# Altium schematic sheet Power_5v_3v3.SchDoc
size C
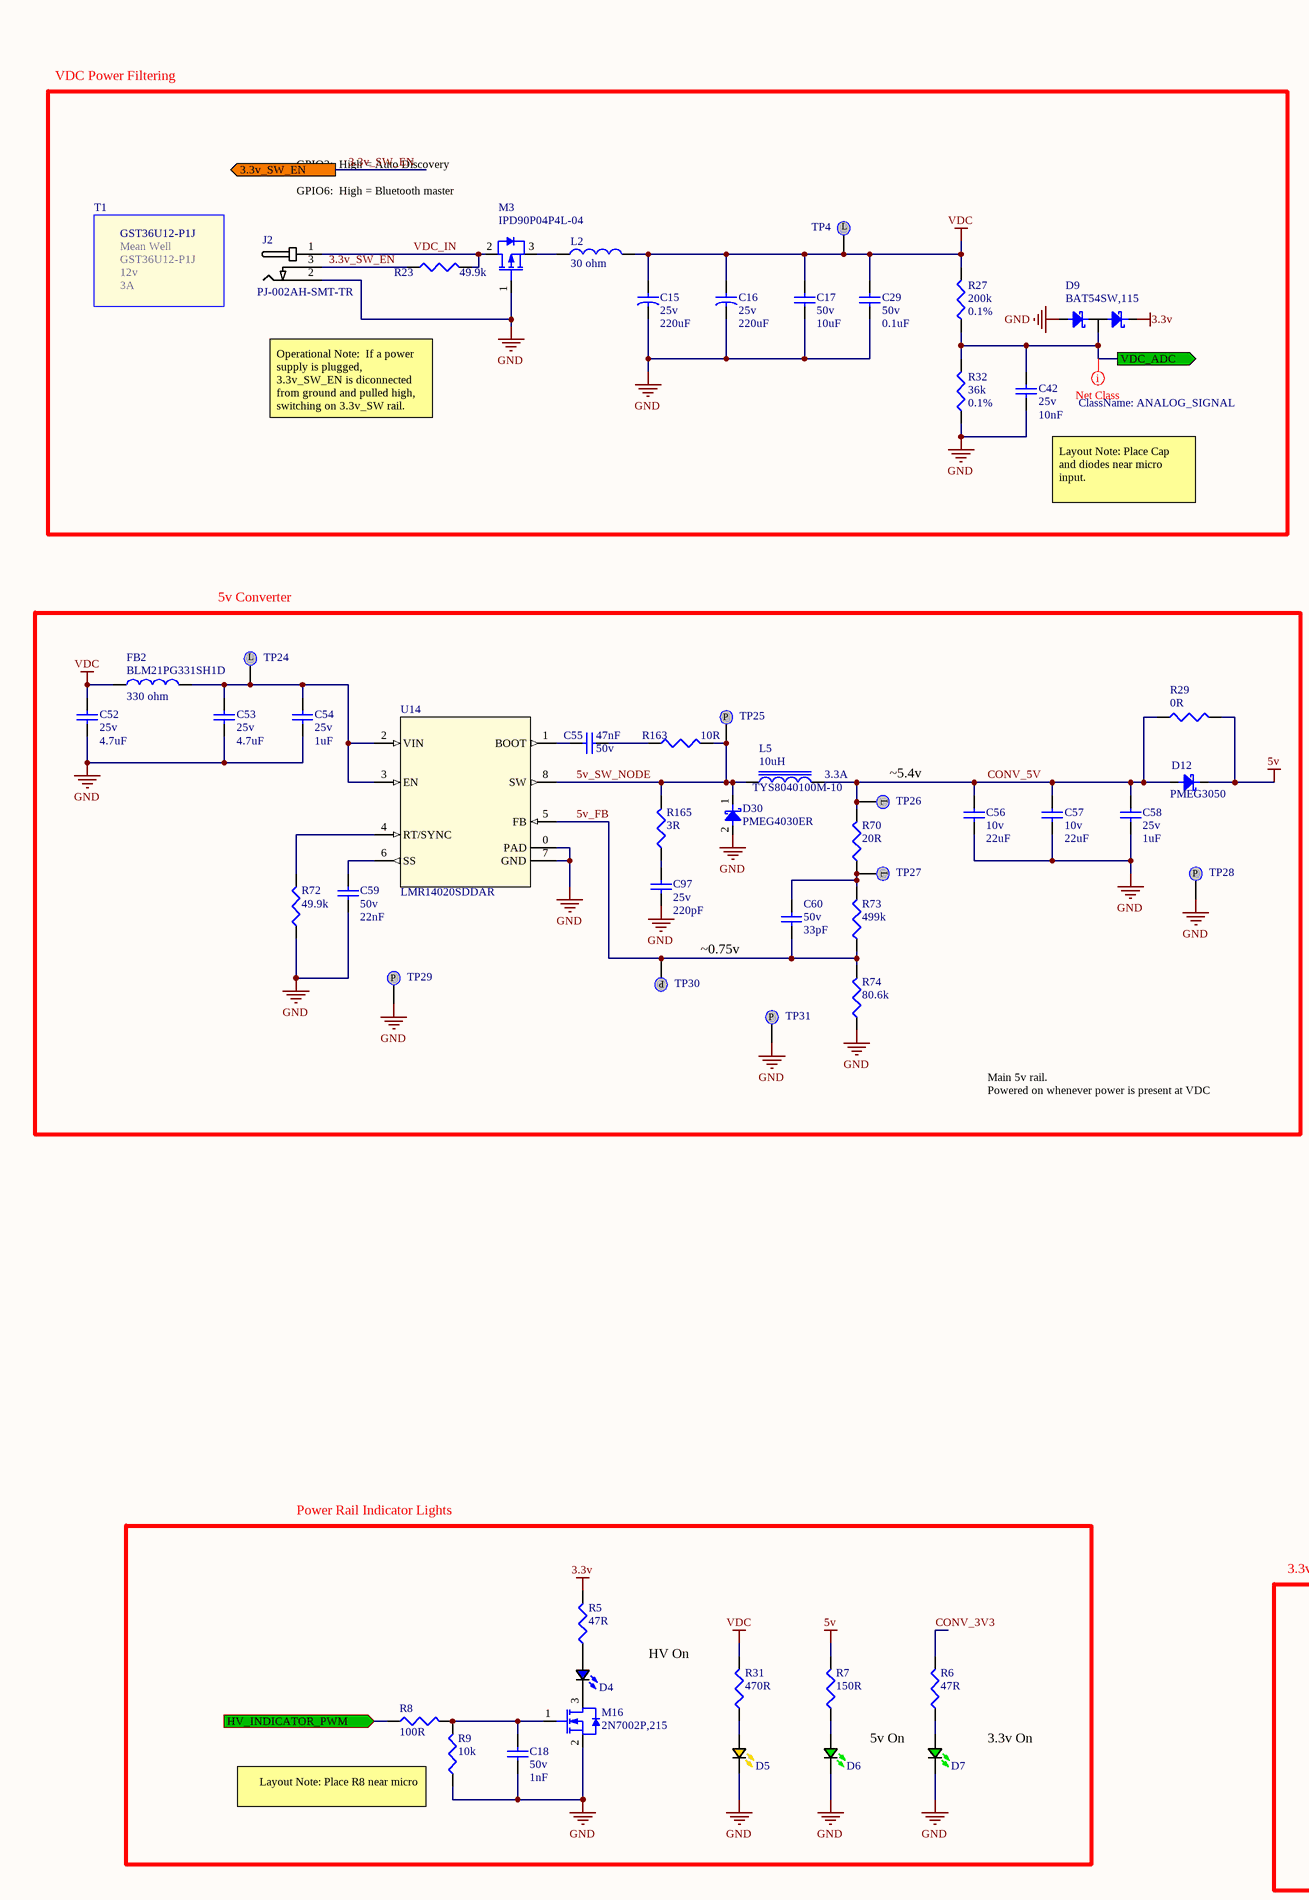
[diagram p0: Power_5v_3v3.SchDoc, left]
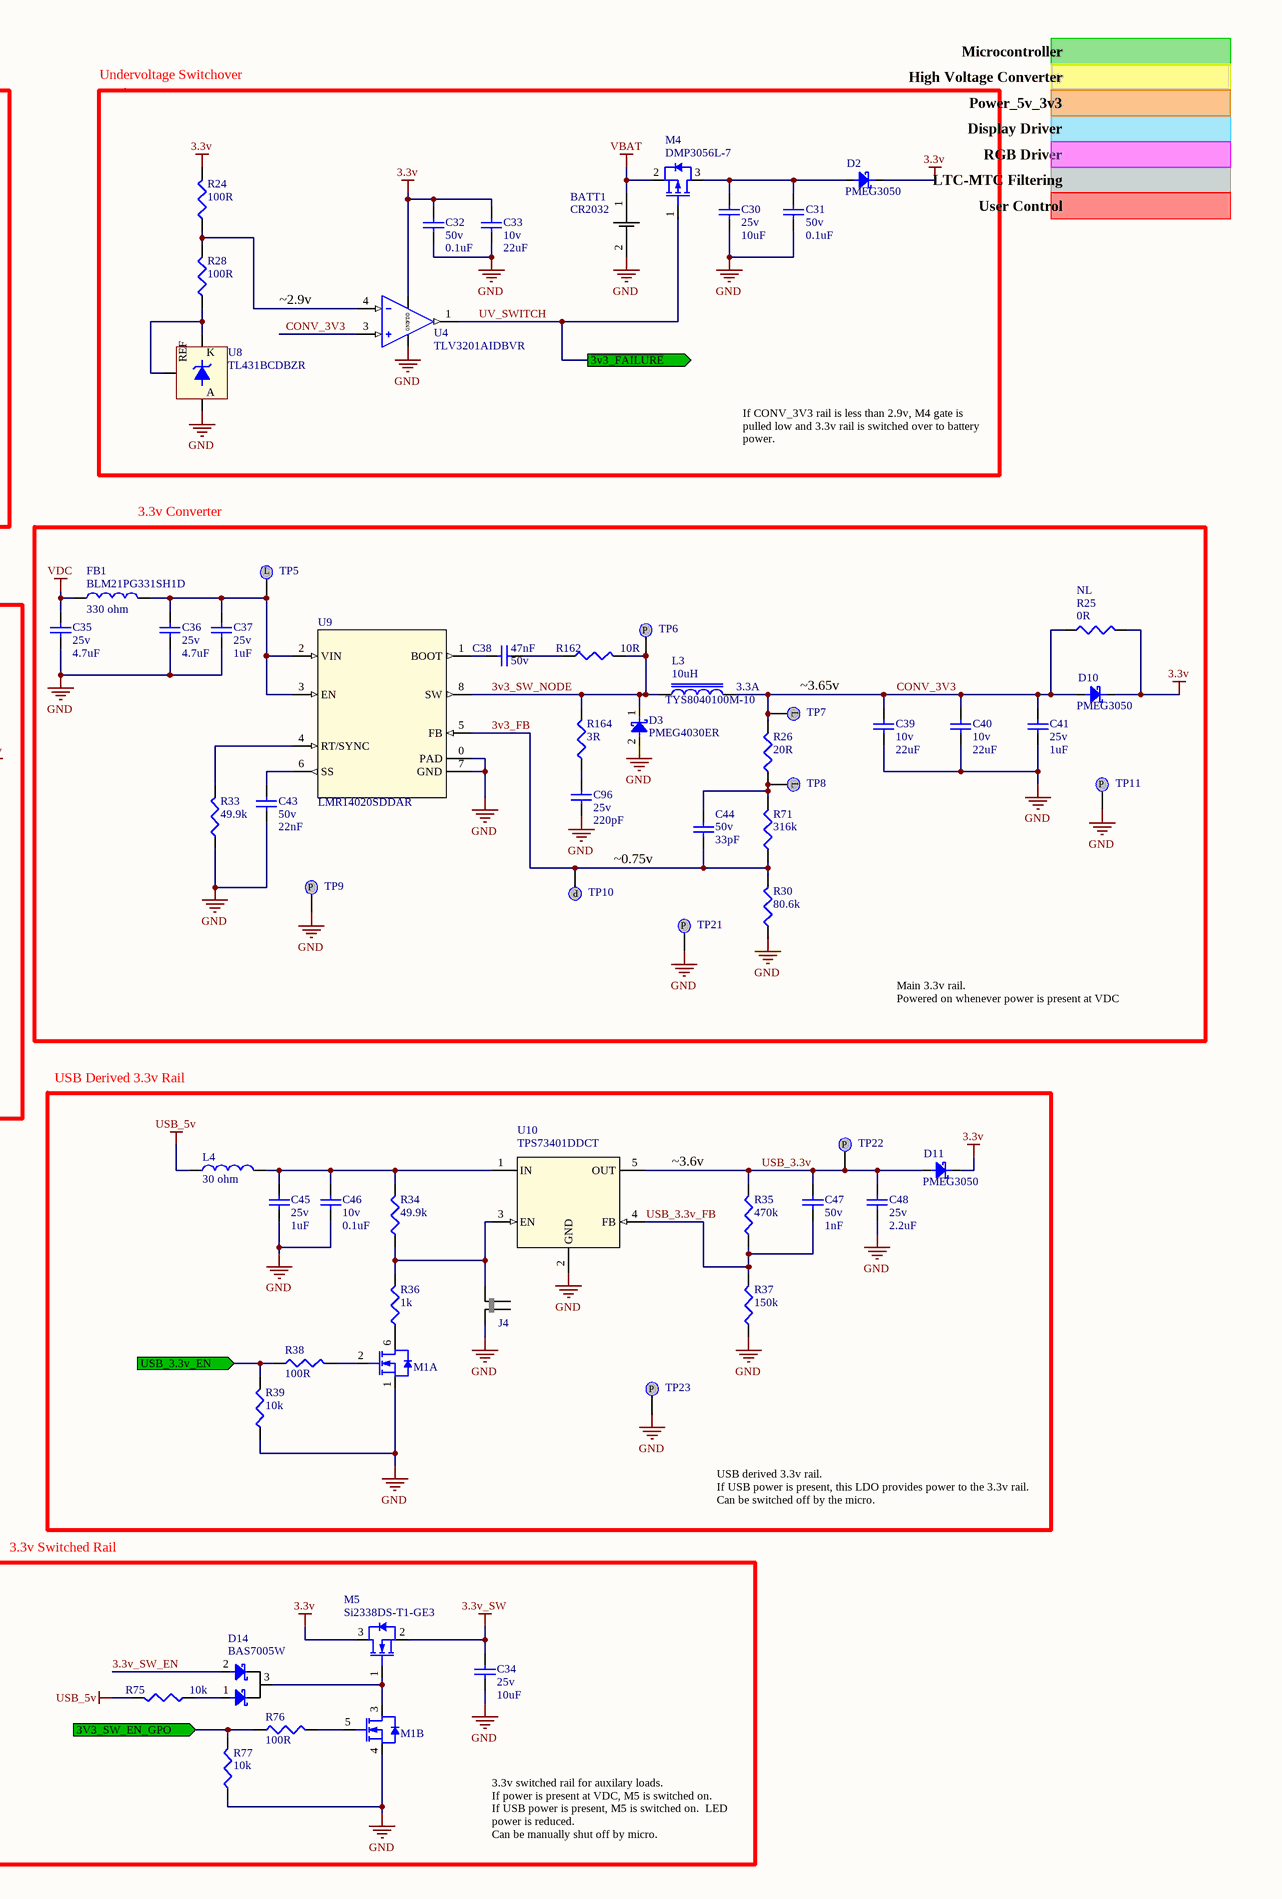
[diagram p1: Power_5v_3v3.SchDoc, right]

## Parts
BATT1  CR2032  [2032 Holder]
C15  Voltage: 25v  [SMD ELEC CAP (D=6.3, L=7.7, H=8)]  (hidden comment: 220uF)
C16  Voltage: 25v  [SMD ELEC CAP (D=6.3, L=7.7, H=8)]  (hidden comment: 220uF)
C17  Voltage: 50v  [CAP1206R]  (hidden comment: 10uF)
C18  Voltage: 50v  [CAP0402R]  (hidden comment: 1nF)
C29  Voltage: 50v  [CAP0603R]  (hidden comment: 0.1uF)
C30  Voltage: 25v  [CAP1206R]  (hidden comment: 10uF)
C31  Voltage: 50v  [CAP0603R]  (hidden comment: 0.1uF)
C32  Voltage: 50v  [CAP0603R]  (hidden comment: 0.1uF)
C33  Voltage: 10v  [CAP1210R]  (hidden comment: 22uF)
C34  Voltage: 25v  [CAP1206R]  (hidden comment: 10uF)
C35  Voltage: 25v  [CAP1206R]  (hidden comment: 4.7uF)
C36  Voltage: 25v  [CAP1206R]  (hidden comment: 4.7uF)
C37  Voltage: 25v  [CAP0805R]  (hidden comment: 1uF)
C38  Voltage: 50v  [CAP0603R]  (hidden comment: 47nF)
C39  Voltage: 10v  [CAP1210R]  (hidden comment: 22uF)
C40  Voltage: 10v  [CAP1210R]  (hidden comment: 22uF)
C41  Voltage: 25v  [CAP0805R]  (hidden comment: 1uF)
C42  Voltage: 25v  [CAP0402R]  (hidden comment: 10nF)
C43  Voltage: 50v  [CAP0603R]  (hidden comment: 22nF)
C44  Voltage: 50v  [CAP0402R]  (hidden comment: 33pF)
C45  Voltage: 25v  [CAP0805R]  (hidden comment: 1uF)
C46  Voltage: 10v  [CAP0402R]  (hidden comment: 0.1uF)
C47  Voltage: 50v  [CAP0402R]  (hidden comment: 1nF)
C48  Voltage: 25v  [CAP1206R]  (hidden comment: 2.2uF)
C52  Voltage: 25v  [CAP1206R]  (hidden comment: 4.7uF)
C53  Voltage: 25v  [CAP1206R]  (hidden comment: 4.7uF)
C54  Voltage: 25v  [CAP0805R]  (hidden comment: 1uF)
C55  Voltage: 50v  [CAP0603R]  (hidden comment: 47nF)
C56  Voltage: 10v  [CAP1210R]  (hidden comment: 22uF)
C57  Voltage: 10v  [CAP1210R]  (hidden comment: 22uF)
C58  Voltage: 25v  [CAP0805R]  (hidden comment: 1uF)
C59  Voltage: 50v  [CAP0603R]  (hidden comment: 22nF)
C60  Voltage: 50v  [CAP0402R]  (hidden comment: 33pF)
C96  Voltage: 25v  [CAP0402R]  (hidden comment: 220pF)
C97  Voltage: 25v  [CAP0402R]  (hidden comment: 220pF)
D2  PMEG3050  [SOD128]
D3  PMEG4030ER  [SOD-123]
D4  LTST-C193TBKT-5A  [LED Blue 0603]  (value not drawn)
D5  LTST-C190AKT  [LED Amber 0603]  (value not drawn)
D6  LTST-S270KGKT  [LED Green 0603]  (value not drawn)
D7  LTST-S270KGKT  [LED Green 0603]  (value not drawn)
D9  BAT54SW,115  [SOT-323]
D10  PMEG3050  [SOD128]
D11  PMEG3050  [SOD128]
D12  PMEG3050  [SOD128]
D14  BAS7005W  [SOT-323]
D30  PMEG4030ER  [SOD-123]
FB1  BLM21PG331SH1D  IMPEDANCE: 330 ohm  [RES0805R]
FB2  BLM21PG331SH1D  IMPEDANCE: 330 ohm  [RES0805R]
J2  PJ-002AH-SMT-TR  [PJ-002AH-SMT-TR]
J4  None  [Jumper_2.54mm_2x1]  (value not drawn)
L2  30 ohm  [RES0805R]
L3  10uH  CURRENT: 3.3A  [TYS8040100M-10]
L4  30 ohm  [RES0805R]
L5  10uH  CURRENT: 3.3A  [TYS8040100M-10]
M1  NX3020NAKV,115  [SOT666-6N]  (value not drawn)  (parts A,B of 2)
M3  IPD90P04P4L-04  [DPAK2]
M4  DMP3056L-7  [SOT23-3M]
M5  Si2338DS-T1-GE3  [SOT23-3M]
M16  2N7002P,215  [SOT23-3M]
R5  47R  [RES0603R]
R6  47R  [RES0603R]
R7  150R  [RES0603R]
R8  100R  [RES0402R]
R9  10k  [RES0402R]
R23  49.9k  [RES0402R]
R24  100R  [RES0402R]
R25  Load: NL  [RES1206R]  (hidden comment: 0R)
R26  20R  [RES0402R]
R27  Tolerance: 0.1%  [RES0402R]  (hidden comment: 200k)
R28  100R  [RES0402R]
R29  0R  [RES1206R]
R30  80.6k  [RES0402R]
R31  470R  [RES0603R]
R32  Tolerance: 0.1%  [RES0402R]  (hidden comment: 36k)
R33  49.9k  [RES0402R]
R34  49.9k  [RES0402R]
R35  470k  [RES0402R]
R36  1k  [RES0402R]
R37  150k  [RES0402R]
R38  100R  [RES0402R]
R39  10k  [RES0402R]
R70  20R  [RES0402R]
R71  316k  [RES0402R]
R72  49.9k  [RES0402R]
R73  499k  [RES0402R]
R74  80.6k  [RES0402R]
R75  10k  [RES0402R]
R76  100R  [RES0402R]
R77  10k  [RES0402R]
R162  10R  [RES0402R]
R163  10R  [RES0402R]
R164  3R  [RES0603R]
R165  3R  [RES0603R]
T1  GST36U12-P1J  MFG: Mean Well  VOUT: 12v  CURRENT: 3A  (mechanical)
TP4  5001  [5001 Testpoint]  (value not drawn)
TP5  5001  [5001 Testpoint]  (value not drawn)
TP6  NONE  [TESTPOINT - 1.5mm Round Pad]  (value not drawn)
TP7  5001  [5001 Testpoint]  (value not drawn)
TP8  5001  [5001 Testpoint]  (value not drawn)
TP9  NONE  [TESTPOINT - 1.5mm Round Pad]  (value not drawn)
TP10  NONE  [TESTPOINT - 1.5mm Round Pad]  (value not drawn)
TP11  NONE  [TESTPOINT - 1.5mm Round Pad]  (value not drawn)
TP21  NONE  [TESTPOINT - 1.5mm Round Pad]  (value not drawn)
TP22  NONE  [TESTPOINT - 1.5mm Round Pad]  (value not drawn)
TP23  NONE  [TESTPOINT - 1.5mm Round Pad]  (value not drawn)
TP24  5001  [5001 Testpoint]  (value not drawn)
TP25  NONE  [TESTPOINT - 1.5mm Round Pad]  (value not drawn)
TP26  5001  [5001 Testpoint]  (value not drawn)
TP27  5001  [5001 Testpoint]  (value not drawn)
TP28  NONE  [TESTPOINT - 1.5mm Round Pad]  (value not drawn)
TP29  NONE  [TESTPOINT - 1.5mm Round Pad]  (value not drawn)
TP30  NONE  [TESTPOINT - 1.5mm Round Pad]  (value not drawn)
TP31  NONE  [TESTPOINT - 1.5mm Round Pad]  (value not drawn)
U4  TLV3201AIDBVR  [SOT23-5]
U8  TL431BCDBZR  [SOT23-3M]
U9  LMR14020SDDAR  [HSOIC-8]
U10  TPS73401DDCT  [SOT23-5]
U14  LMR14020SDDAR  [HSOIC-8]

## Blocks framed on the sheet
VDC Power Filtering: C15-C17 C29 C42 D9 J2 L2 M3 R23 R27 R32 T1 TP4
3.3v Switched Rail: C34 D14 M1 M5 R75-R77

## Ports
3.3v_SW_EN (out), 3V3_SW_EN_GPO (in), HV_INDICATOR_PWM (in), USB_3.3v_EN (in), VDC_ADC (out), ~{3v3_FAILURE} (out)

## Nets
3.3v: C32.1 C33.1 D2.1(K) D9.2(A) D10.1(K) D11.1(K) M5.3(DRAIN) R5.2 R24.2 R25.2 U4.5(VDD)
3.3v_SW: C34.1 M5.2(SOURCE)
5v: D12.1(K) R7.2 R29.2
GND: BATT1.2 C15.1 C16.1 C17.2 C18.2 C29.2 C30.2 C31.2 C32.2 C33.2 C34.2 C35.2 C36.2 C37.2 C39.2 C40.2 C41.2 C42.2 C43.2 C45.2 C46.2 C48.2 C52.2 C53.2 C54.2 C56.2 C57.2 C58.2 C59.2 C96.2 C97.2 D3.2(A) D5.1(K) D6.1(K) D7.1(K) D9.1(A) D30.2(A) J2.2(RING) J4.1 M1.1(S1) M1.4(S2) M3.1(GATE) M16.2(SOURCE) R9.1 R30.1 R32.1 R33.1 R37.1 R39.1 R72.1 R74.1 R77.1 TP9.1 TP11.1 TP21.1 TP23.1 TP28.1 TP29.1 TP31.1 U4.2(GND) U8.3(A) U9.0(PAD) U9.7(GND) U10.2(GND) U14.0(PAD) U14.7(GND)
USB_5v: L4.1 R75.2
VBAT: BATT1.1 M4.2(DRAIN)
VDC: C15.2 C16.2 C17.1 C29.1 C35.1 C52.1 FB1.1 FB2.1 L2.2 R27.2 R31.2 TP4.1
3.3v_SW_EN: D14.2(A2) J2.3(SWITCH) R23.1 ; port 3.3v_SW_EN
3v3_FB: C44.2 R30.2 R71.1 TP10.1 U9.5(FB)
3V3_SW_EN_GPO: R76.1 R77.2 ; port 3V3_SW_EN_GPO
3v3_SW_NODE: D3.1(K) L3.1 R162.2 R164.2 TP6.1 U9.8(SW)
5v_FB: C60.2 R73.1 R74.2 TP30.1 U14.5(FB)
5v_SW_NODE: D30.1(K) L5.1 R163.2 R165.2 TP25.1 U14.8(SW)
CONV_3V3: C39.1 C40.1 C41.1 D10.2(A) L3.2 R6.2 R25.1 R26.2 TP7.1 U4.3(+)
CONV_5V: C56.1 C57.1 C58.1 D12.2(A) L5.2 R29.1 R70.2 TP26.1
HV_INDICATOR_PWM: R8.1 ; port HV_INDICATOR_PWM
USB_3.3v: C47.1 C48.1 D11.2(A) R35.2 TP22.1 U10.5(OUT)
USB_3.3v_EN: R38.1 R39.2 ; port USB_3.3v_EN
USB_3.3v_FB: C47.2 R35.1 R37.2 U10.4(FB)
UV_SWITCH: M4.1(GATE) U4.1(OUT) ; port ~{3v3_FAILURE}
VDC_ADC: C42.1 D9.3(AK) R27.1 R32.2 ; port VDC_ADC
VDC_IN: J2.1(PIN) M3.2(DRAIN) R23.2
NetC18_1: C18.1 M16.1(GATE) R8.2 R9.2
NetC30_1: C30.1 C31.1 D2.2(A) M4.3(SOURCE)
NetC36_1: C36.1 C37.1 FB1.2 TP5.1 U9.2(VIN) U9.3(EN)
NetC38_1: C38.1 U9.1(BOOT)
NetC38_2: C38.2 R162.1
NetC43_1: C43.1 U9.6(SS)
NetC44_1: C44.1 R26.1 R71.2 TP8.1
NetC45_1: C45.1 C46.1 L4.2 R34.2 U10.1(IN)
NetC53_1: C53.1 C54.1 FB2.2 TP24.1 U14.2(VIN) U14.3(EN)
NetC55_1: C55.1 U14.1(BOOT)
NetC55_2: C55.2 R163.1
NetC59_1: C59.1 U14.6(SS)
NetC60_1: C60.1 R70.1 R73.2 TP27.1
NetC96_1: C96.1 R164.1
NetC97_1: C97.1 R165.1
NetD4_1: D4.1(K) M16.3(DRAIN)
NetD4_2: D4.2(A) R5.1
NetD5_2: D5.2(A) R31.1
NetD6_2: D6.2(A) R7.1
NetD7_2: D7.2(A) R6.1
NetD14_1: D14.1(A1) R75.1
NetD14_3: D14.3(C) M1.3(D2) M5.1(GATE)
NetJ4_2: J4.2 R34.1 R36.2 U10.3(EN)
NetL2_1: L2.1 M3.3(SOURCE)
NetM1_2: M1.2(G1) R38.2
NetM1_5: M1.5(G2) R76.2
NetM1_6: M1.6(D1) R36.1
NetR24_1: R24.1 R28.2 U4.4(-)
NetR28_1: R28.1 U8.1(K) U8.2(REF)
NetR33_2: R33.2 U9.4(RT/SYNC)
NetR72_2: R72.2 U14.4(RT/SYNC)

## Layout directives
net class ANALOG_SIGNAL: VDC_ADC

## Notes on the sheet
- Microcontroller
- High Voltage Converter
- Undervoltage Switchover
- Display Driver
- Power_5v_3v3
- RGB Driver
- LTC-MTC Filtering
- User Control
- ~2.9v
- Operational Note:  If a power supply is plugged, 3.3v_SW_EN is diconnected from ground and pulled high, switching on 3.3v_SW rail.
- If CONV_3V3 rail is less than 2.9v, M4 gate is pulled low and 3.3v rail is switched over to battery power.
- (near C42) Layout Note: Place Cap and diodes near micro input.
- 3.3v Converter
- 5v Converter
- (near TP7) ~3.65v
- (near TP26) ~5.4v
- ~0.75v
- Main 3.3v rail.
  Powered on whenever power is present at VDC
- Main 5v rail.
  Powered on whenever power is present at VDC
- USB Derived 3.3v Rail
- ~3.6v
- Power Rail Indicator Lights
- USB derived 3.3v rail.
  If USB power is present, this LDO provides power to the 3.3v rail.
  Can be switched off by the micro.
- HV On
- (near D6) 5v On
- (near D7) 3.3v On
- (near R9) Layout Note: Place R8 near micro
- 3.3v switched rail for auxilary loads.
  If power is present at VDC, M5 is switched on.
  If USB power is present, M5 is switched on.  LED power is reduced.
  Can be manually shut off by micro.
- (in symbol GST36U12-P1J) GPIO3:  High = Auto Discovery / GPIO6:  High = Bluetooth master / GPIO7:  Low = 115200bps, High = 9600bps /
- (in symbol Testpoint 1.5mm Pad) P
- (in symbol Testpoint Loop) L

## Library data of the parts
BATT1 = 2032 Coin Cell Holder: SMD Coin Cell Holder for CR2032; MFG_PN: SMTU2032-LF.TR; MFG: RENATA; CELL_TYPE: CR2032
C15 C16 = 220uF / 25v: Tolerance: 20%; MFG_PN: EEE-FTE221XAP; MFG: PANASONIC; ESR: 160mohm; LOAD: NL; Value: 220uF
C17 = 10uF 50v (1206): Tolerance: 10%; MFG_PN: C3216X5R1H106K160AB; MFG: TDK; LOAD: NL; Value: 10uF
C18 C47 = 1nF 50v (0402): Tolerance: 10%; MFG_PN: VJ0402Y102KXAAC; MFG: Vishay; LOAD: NL; Value: 1nF
C29 C31 C32 = 0.1uF 50v (0603): MFG_PN: VJ0603V104ZXAPW1BC; MFG: Vishay; LOAD: NL; Value: 0.1uF
C30 C34 = 10uF 25v (1206): Tolerance: 10%; MFG_PN: GRJ31CR71E106KE11L; MFG: MURATA; LOAD: NL; Value: 10uF
C33 C39 C40 C56 C57 = 22uF 10v (1210): Tolerance: 10%; MFG_PN: GCM32ER71A226ME12L; MFG: MURATA; LOAD: NL; Value: 22uF
C35 C36 C52 C53 = 4.7uF 25v (1206): Tolerance: 10%; MFG_PN: GCM31CR71E475KA55L; MFG: Murata; LOAD: NL; Value: 4.7uF
C37 C41 C45 C54 C58 = 1uF 25v (0805): MFG_PN: VJ0805V105ZXXTW1BC; MFG: Vishay; LOAD: NL; Value: 1uF
C38 C55 = 47nF 50v (0603): Tolerance: 10%; MFG_PN: VJ0603Y473KXACW1BC; MFG: VISHAY; Value: 47nF
C42 = 10nF 25v (0402): Tolerance: 5%; MFG_PN: VJ0402Y103JXXAC; MFG: Vishay; LOAD: NL; Value: 10nF
C43 C59 = 22nF 50v (0603): Tolerance: 5%; MFG1_PN: VJ0603Y223KXACW1BC; MFG1: Vishay; Value: 22nF
C44 C60 = 33pF 50v (0402): Tolerance: 5%; MFG_PN: VJ0402A330JXACW1BC; MFG: Vishay; LOAD: NL; Value: 33pF
C46 = 0.1uF 10v (0402): Tolerance: 20%; MFG_PN: VJ0402G104MXQCW1BC; MFG: Vishay; LOAD: NL; Value: 0.1uF
C48 = 2.2uF 25v (1206): MFG1_PN: VJ1206V225ZXXRW1BC; MFG1: Vishay; Value: 2.2uF
C96 C97 = 220pF 25v (0402): Tolerance: 5%; MFG_PN: GRM1555C1E221JA01D; MFG: Murata; LOAD: NL; Value: 220pF
D2 D10-D12 = PMEG3050EP: MFG: NXP; CURRENT: 5A; VF: 0.35v; MFG_PN: PMEG3050EP,115
D3 D30 = PMEG4030ER: MFG: NXP; CURRENT: 3A; VF: 0.54v; MFG_PN: PMEG4030ER,115
D4 = LED Blue 0603: MFG: Lite On; VFORWARD: 2.8v; CURRENT: 20mA; COLOR: Blue; MFG_PN: LTST-C193TBKT-5A
D5 = LED Amber 0603: MFG: Lite On; VFORWARD: 2.1v; CURRENT: 20mA; COLOR: Amber; MFG_PN: LTST-C190AKT
D6 D7 = LED Green 0603: MFG: Lite On; VFORWARD: 2v; CURRENT: 20mA; COLOR: Green; MFG_PN: LTST-S270KGKT
D9 = BAT54S: Series connected dual Schottky diode; MFG: NXP; CONFIG: SERIES DUAL; REV_VOLTAGE: 30v; MFG_PN: BAT54SW,115
D14 = BAS7005WH6327XTSA1: Schottky, Dual, Common Cathode; MFG: Vishay; Value: *; CONFIGURATION: COMMON CATHODE; MFG_PN: BAS7005WH6327XTSA1
FB1 FB2 = BLM21PG331SH1D (0805): MFG: MURATA; CURRENT: 3A; LOAD: NL; TOLERANCE: 20%; MFG_PN: BLM21PG331SH1D
J2 = PJ-002AH-SMT-TR: 2.0mm ID/6.5mm OD Barrel Plug; MFG: CUI; VOLTAGE: 16v; CURRENT: 5A; MFG_PN: PJ-002AH-SMT-TR
J4 = Jumper x1: Jumper_Single_2.54mm
L2 L4 = EMI Ferrite (0805): MFG: MURATA; MFG_PN: BLM21PG300SN1D; CURRENT: 3A; LOAD: NL; TOLERANCE: 20%; IMPEDANCE: 30 ohm
L3 L5 = 10uH 3.3A: Inductor, 10uH, 3.3A; MFG: LAIRD; RES: 29mOhm; ISAT: 3.6A; MFG_PN: TYS8040100M-10; VALUE: 10uH
M1 = NX3020NAKV: NFET_DUAL_200mA_30v; LOAD: NL; MFG: NXP; VDS_MAX: 30v; I_MAX: 200mA; P_MAX: 1.1W; RDS_ON: 2.7; VGS_MAX: *; MFG_PN: NX3020NAKV,115
M3 = IPD90P04P4L-04: PFET_SINGLE_90A_40v; LOAD: NL; MFG: INFINEON; VDS_MAX: -40v; I_MAX: 90A; VGS_MAX: 16v; P_MAX: 125W; RDS_ON: 4.3m; VGS_TH: -2.2v; Q_GATE: 176nC; MFG_PN: IPD90P04P4L-04
M4 = DMP3056L: PFET_SINGLE_4.3A_30v; LOAD: NL; MFG: DIODES_INC; VDS_MAX: -30v; I_MAX: -4.3A; VGS_MAX: 25v; P_MAX: 1.38W; RDS_ON: 35m; VGS_TH: -1v; MFG_PN: DMP3056L-7
M5 = Si2338DS: NFET_SINGLE_6A_30V; LOAD: NL; MFG: VISHAY; VDS_MAX: 30v; I_MAX: 6A; VGS_MAX: 20v; RDS_ON: 23m; Q_GATE: 8.2nC; P_MAX: *; MFG_PN: Si2338DS-T1-GE3
M16 = 2N7002: NFET_SINGLE_360mA_60V; LOAD: NL; MFG: NXP; VDS_MAX: 60v; I_MAX: 360mA; VGS_MAX: 20v; P_MAX: *; RDS_ON: *; MFG_PN: 2N7002P,215
R5 R6 = 47R (0603): Tolerance: 1%; POWER: 0.1W; Load: NL; MFG_PN: CRCW060347R0FKEA; MFG: Vishay; Value: 47R
R7 = 150R (0603): Tolerance: 1%; POWER: 0.1W; Load: NL; MFG_PN: CRCW0603150RFKEA; MFG: Vishay; Value: 150R
R8 = 100R (0402): Tolerance: 1%; POWER: 63mW; Load: NL; MFG_PN: CRCW0402100RFKED; MFG: Vishay; Value: 100R
R9 = 10k (0402): Tolerance: 1%; POWER: 63mW; Load: NL; MFG_PN: CRCW040210K0FKED; MFG: Vishay; Value: 10k
R23 R33 R34 R72 = 49.9k (0402): Tolerance: 1%; POWER: 63mW; MFG_PN: CRCW040249K9FKED; MFG: Vishay; Load: NL; Value: 49.9k
R24 R28 R38 R76 = 100R (0402): Tolerance: 1%; POWER: 63mW; MFG_PN: CRCW0402100RFKED; MFG: Vishay; Load: NL; Value: 100R
R25 = 0R (1206): 0R, 1206; MFG_PN: CRCW12060000Z0EA; MFG: Vishay; Value: 0R
R26 R70 = 20R (0402): Tolerance: 1%; POWER: 63mW; MFG_PN: CRCW040220R0FKED; MFG: Vishay; Load: NL; Value: 20R
R27 = 200k   0.1% (0402): POWER: 63mW; MFG_PN: MCS04020D2003BE100; MFG: Vishay; Load: NL; Value: 200k
R29 = 0R (1206): 0R, 1206; MFG_PN: CRCW12060000Z0EA; MFG: Vishay; Load: NL; Value: 0R
R30 R74 = 80.6k (0402): Tolerance: 1%; POWER: 63mW; MFG_PN: CRCW040280K6FKED; MFG: Vishay; Load: NL; Value: 80.6k
R31 = 470R (0603): Tolerance: 1%; POWER: 0.1W; MFG_PN: CRCW0603470RFKEA; MFG: Vishay; Load: NL; Value: 470R
R32 = 36k   0.1% (0402): POWER: 63mW; MFG_PN: TNPW040236K0BEED; MFG: Vishay; Load: NL; Value: 36k
R35 = 470k (0402): Tolerance: 1%; POWER: 63mW; MFG_PN: CRCW0402470KFKED; MFG: Vishay; Load: NL; Value: 470k
R36 = 1k (0402): Tolerance: 1%; POWER: 63mW; MFG_PN: CRCW04021K00FKED; MFG: Vishay; Load: NL; Value: 1k
R37 = 150k (0402): Tolerance: 1%; POWER: 63mW; MFG_PN: CRCW0402150KFKED; MFG: Vishay; Load: NL; Value: 150k
R39 R75 R77 = 10k (0402): Tolerance: 1%; POWER: 63mW; MFG_PN: CRCW040210K0FKED; MFG: Vishay; Load: NL; Value: 10k
R71 = 316k (0402): Tolerance: 1%; POWER: 63mW; MFG_PN: CRCW0402316KFKED; MFG: Vishay; Load: NL; Value: 316k
R73 = 499k (0402): Tolerance: 1%; POWER: 63mW; MFG_PN: CRCW0402499KFKED; MFG: Vishay; Load: NL; Value: 499k
R162 R163 = 10R (0402): Tolerance: 1%; POWER: 63mW; MFG_PN: CRCW040210R0FKED; MFG: Vishay; Load: NL; Value: 10R
R164 R165 = 3R (0603): Tolerance: 1%; POWER: 0.1W; MFG_PN: CRCW06033R00FKEA; MFG: Vishay; Load: NL; Value: 3R
T1 = GST36U12-P1J: 12v/3A Wall Mount AC Adapter; PLUG_TYPE: 2.1mm Barrel Plug; MFG_PN: GST36U12-P1J
TP4 TP5 TP7 TP8 TP24 TP26 TP27 = Testpoint Loop: MFG: KEYSTONE; MFG_PN: 5001
TP6 TP9-TP11 TP21-TP23 TP25 TP28-TP31 = Testpoint 1.5mm Pad: 1.5mm Testpoint
U4 = TLV3201AIDBVR: High Speed Analog Comparator; LOAD: NL; MFG: TI; OUTPUT_TYPE: PUSH-PULL; RESPONSE_TIME: 47ns; MFG_PN: TLV3201AIDBVR
U8 = TL431: Voltage Reference; MFG: TI; MFG_PN: TL431BCDBZR
U9 U14 = LMR14020SDDAR: Buck Regulator, Adjustable, 2A; MFG: TI; VOUT: 0.8-24v; MFG_PN: LMR14020SDDAR; IOUT: 2A
U10 = TPS73401DDCT: TPS73401DDCT, LDO, 250mA, Adj; MFG: TI; MFG_PN: TPS73401DDCT; CURRENT: 250mA; VOUT: Adj